# Altium project 2SlotElevator.PrjPcb
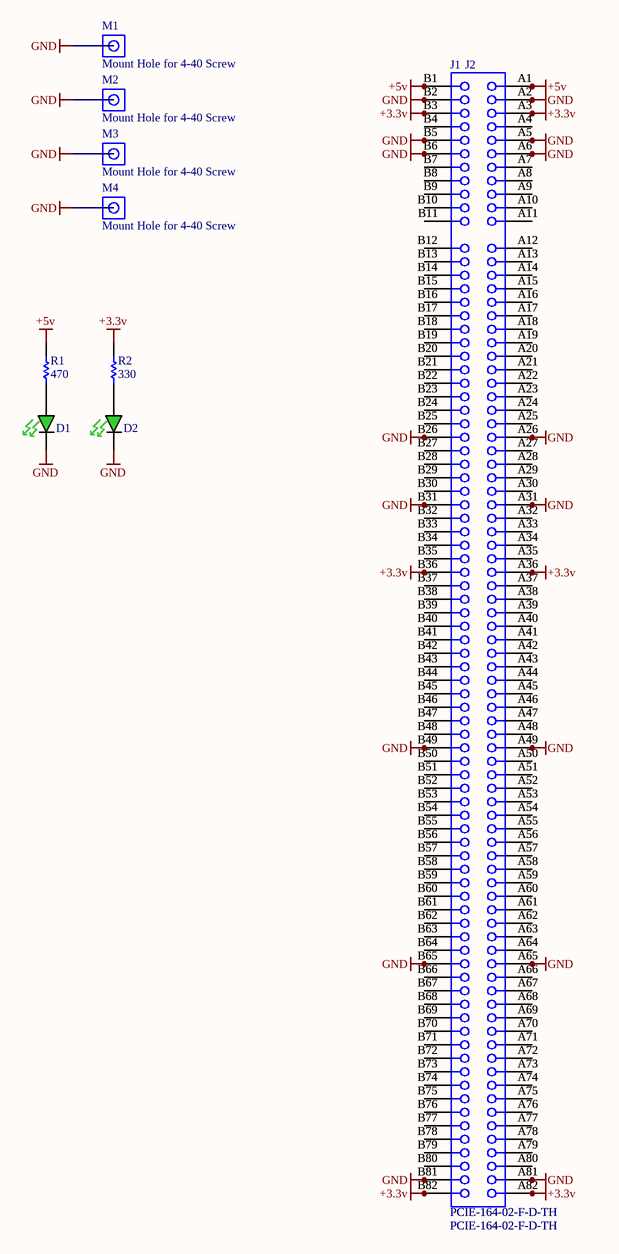
[diagram p0: 2SlotElevator.SchDoc]
DRCDate: 4/22/2012; Engineer: Eli Hughes; Rev: a; Title: 2 Slot Elevator
1 sheet, 10 parts. Net scope: global (net labels, ports and power ports of the same name join across sheets).
Board file: 2SlotElevator.PcbDoc

## Sheet 2SlotElevator.SchDoc: 2 Slot Elevator
size Tabloid

### Parts
D1  LED 3X1.5MM 568NM GN WTR CLR SMD  [LED_1206 - GREEN]  (value not drawn)
D2  LED 3X1.5MM 568NM GN WTR CLR SMD  [LED_1206 - GREEN]  (value not drawn)
J1  PCIE-164-02-F-D-TH  [PCIE-164-02-F-D-TH]
J2  PCIE-164-02-F-D-TH  [PCIE-164-02-F-D-TH]
M1  Mount Hole for 4-40 Screw  [4-40 Hole]  (no BOM)
M2  Mount Hole for 4-40 Screw  [4-40 Hole]  (no BOM)
M3  Mount Hole for 4-40 Screw  [4-40 Hole]  (no BOM)
M4  Mount Hole for 4-40 Screw  [4-40 Hole]  (no BOM)
R1  470  [R0603]
R2  330  [R0603]

### Nets
+3.3v: J1.A3 J1.A36 J1.A82 J1.B3 J1.B36 J1.B82 J2.A3 J2.A36 J2.A82 J2.B3 J2.B36 J2.B82 R2.2
+5v: J1.A1 J1.B1 J2.A1 J2.B1 R1.2
GND: D1.C D2.C J1.A2 J1.A5 J1.A6 J1.A26 J1.A31 J1.A49 J1.A65 J1.A81 J1.B2 J1.B5 J1.B6 J1.B26 J1.B31 J1.B49 J1.B65 J1.B81 J2.A2 J2.A5 J2.A6 J2.A26 J2.A31 J2.A49 J2.A65 J2.A81 J2.B2 J2.B5 J2.B6 J2.B26 J2.B31 J2.B49 J2.B65 J2.B81 M1.1 M2.1 M3.1 M4.1
NetD1_A: D1.A R1.1
NetD2_A: D2.A R2.1
NetJ1_A4: J1.A4 J2.A4
NetJ1_A7: J1.A7 J2.A7
NetJ1_A8: J1.A8 J2.A8
NetJ1_A9: J1.A9 J2.A9
NetJ1_A10: J1.A10 J2.A10
NetJ1_A11: J1.A11 J2.A11
NetJ1_A12: J1.A12 J2.A12
NetJ1_A13: J1.A13 J2.A13
NetJ1_A14: J1.A14 J2.A14
NetJ1_A15: J1.A15 J2.A15
NetJ1_A16: J1.A16 J2.A16
NetJ1_A17: J1.A17 J2.A17
NetJ1_A18: J1.A18 J2.A18
NetJ1_A19: J1.A19 J2.A19
NetJ1_A20: J1.A20 J2.A20
NetJ1_A21: J1.A21 J2.A21
NetJ1_A22: J1.A22 J2.A22
NetJ1_A23: J1.A23 J2.A23
NetJ1_A24: J1.A24 J2.A24
NetJ1_A25: J1.A25 J2.A25
NetJ1_A27: J1.A27 J2.A27
NetJ1_A28: J1.A28 J2.A28
NetJ1_A29: J1.A29 J2.A29
NetJ1_A30: J1.A30 J2.A30
NetJ1_A32: J1.A32 J2.A32
NetJ1_A33: J1.A33 J2.A33
NetJ1_A34: J1.A34 J2.A34
NetJ1_A35: J1.A35 J2.A35
NetJ1_A37: J1.A37 J2.A37
NetJ1_A38: J1.A38 J2.A38
NetJ1_A39: J1.A39 J2.A39
NetJ1_A40: J1.A40 J2.A40
NetJ1_A41: J1.A41 J2.A41
NetJ1_A42: J1.A42 J2.A42
NetJ1_A43: J1.A43 J2.A43
NetJ1_A44: J1.A44 J2.A44
NetJ1_A45: J1.A45 J2.A45
NetJ1_A46: J1.A46 J2.A46
NetJ1_A47: J1.A47 J2.A47
NetJ1_A48: J1.A48 J2.A48
NetJ1_A50: J1.A50 J2.A50
NetJ1_A51: J1.A51 J2.A51
NetJ1_A52: J1.A52 J2.A52
NetJ1_A53: J1.A53 J2.A53
NetJ1_A54: J1.A54 J2.A54
NetJ1_A55: J1.A55 J2.A55
NetJ1_A56: J1.A56 J2.A56
NetJ1_A57: J1.A57 J2.A57
NetJ1_A58: J1.A58 J2.A58
NetJ1_A59: J1.A59 J2.A59
NetJ1_A60: J1.A60 J2.A60
NetJ1_A61: J1.A61 J2.A61
NetJ1_A62: J1.A62 J2.A62
NetJ1_A63: J1.A63 J2.A63
NetJ1_A64: J1.A64 J2.A64
NetJ1_A66: J1.A66 J2.A66
NetJ1_A67: J1.A67 J2.A67
NetJ1_A68: J1.A68 J2.A68
NetJ1_A69: J1.A69 J2.A69
NetJ1_A70: J1.A70 J2.A70
NetJ1_A71: J1.A71 J2.A71
NetJ1_A72: J1.A72 J2.A72
NetJ1_A73: J1.A73 J2.A73
NetJ1_A74: J1.A74 J2.A74
NetJ1_A75: J1.A75 J2.A75
NetJ1_A76: J1.A76 J2.A76
NetJ1_A77: J1.A77 J2.A77
NetJ1_A78: J1.A78 J2.A78
NetJ1_A79: J1.A79 J2.A79
NetJ1_A80: J1.A80 J2.A80
NetJ1_B4: J1.B4 J2.B4
NetJ1_B7: J1.B7 J2.B7
NetJ1_B8: J1.B8 J2.B8
NetJ1_B9: J1.B9 J2.B9
NetJ1_B10: J1.B10 J2.B10
NetJ1_B11: J1.B11 J2.B11
NetJ1_B12: J1.B12 J2.B12
NetJ1_B13: J1.B13 J2.B13
NetJ1_B14: J1.B14 J2.B14
NetJ1_B15: J1.B15 J2.B15
NetJ1_B16: J1.B16 J2.B16
NetJ1_B17: J1.B17 J2.B17
NetJ1_B18: J1.B18 J2.B18
NetJ1_B19: J1.B19 J2.B19
NetJ1_B20: J1.B20 J2.B20
NetJ1_B21: J1.B21 J2.B21
NetJ1_B22: J1.B22 J2.B22
NetJ1_B23: J1.B23 J2.B23
NetJ1_B24: J1.B24 J2.B24
NetJ1_B25: J1.B25 J2.B25
NetJ1_B27: J1.B27 J2.B27
NetJ1_B28: J1.B28 J2.B28
NetJ1_B29: J1.B29 J2.B29
NetJ1_B30: J1.B30 J2.B30
NetJ1_B32: J1.B32 J2.B32
NetJ1_B33: J1.B33 J2.B33
NetJ1_B34: J1.B34 J2.B34
NetJ1_B35: J1.B35 J2.B35
NetJ1_B37: J1.B37 J2.B37
NetJ1_B38: J1.B38 J2.B38
NetJ1_B39: J1.B39 J2.B39
NetJ1_B40: J1.B40 J2.B40
NetJ1_B41: J1.B41 J2.B41
NetJ1_B42: J1.B42 J2.B42
NetJ1_B43: J1.B43 J2.B43
NetJ1_B44: J1.B44 J2.B44
NetJ1_B45: J1.B45 J2.B45
NetJ1_B46: J1.B46 J2.B46
NetJ1_B47: J1.B47 J2.B47
NetJ1_B48: J1.B48 J2.B48
NetJ1_B50: J1.B50 J2.B50
NetJ1_B51: J1.B51 J2.B51
NetJ1_B52: J1.B52 J2.B52
NetJ1_B53: J1.B53 J2.B53
NetJ1_B54: J1.B54 J2.B54
NetJ1_B55: J1.B55 J2.B55
NetJ1_B56: J1.B56 J2.B56
NetJ1_B57: J1.B57 J2.B57
NetJ1_B58: J1.B58 J2.B58
NetJ1_B59: J1.B59 J2.B59
NetJ1_B60: J1.B60 J2.B60
NetJ1_B61: J1.B61 J2.B61
NetJ1_B62: J1.B62 J2.B62
NetJ1_B63: J1.B63 J2.B63
NetJ1_B64: J1.B64 J2.B64
NetJ1_B66: J1.B66 J2.B66
NetJ1_B67: J1.B67 J2.B67
NetJ1_B68: J1.B68 J2.B68
NetJ1_B69: J1.B69 J2.B69
NetJ1_B70: J1.B70 J2.B70
NetJ1_B71: J1.B71 J2.B71
NetJ1_B72: J1.B72 J2.B72
NetJ1_B73: J1.B73 J2.B73
NetJ1_B74: J1.B74 J2.B74
NetJ1_B75: J1.B75 J2.B75
NetJ1_B76: J1.B76 J2.B76
NetJ1_B77: J1.B77 J2.B77
NetJ1_B78: J1.B78 J2.B78
NetJ1_B79: J1.B79 J2.B79
NetJ1_B80: J1.B80 J2.B80

### Notes on the sheet
- 2
- Wavenumber
- pl
- -1
- Rev:
- Technologies
- Sheet
- of

### Library data of the parts
D1 D2 = APL3015SGC-F01: Manufacturer: Kingbright Corp; Color: Green; Current - Test: 20mA; Wavelength - Peak: 565nm; Millicandela Rating: 20mcd; Voltage - Forward (Vf) Typ: 2.2V; Lens Type: Clear; Lens Style/Size: Rectangle, 2mm x 1.5mm; Viewing Angle: 70°; Value: LED 3X1.5MM 568NM GN WTR CLR SMD; Supplier 1: Digi-Key; Manufacturer Part Number: APL3015SGC-F01; RoHS: RoHS Compliant; Description: LED 3X1.5MM 568NM GN WTR CLR SMD; Category: Optoelectronics; Stock 1: 7999; Pricing 1: 1=0.15, 10=0.113, 25=0.09, 100=0.0825, 250=0.075, 500=0.0675, 1000=0.06 (USD); Luminous Flux @ Current - Test: -; Wavelength - Dominant: 568nm; Size / Dimension: 3.00mm L x 1.50mm W; Height: 1.40mm; Package / Case: 1206 (3216 Metric); Mounting Type: Surface Mount; Packaging: Cut Tape (CT); ComponentLink1URL: http://www.us.kingbright.com/images/catalog/SPEC/APL3015SGC-F01.pdf; ComponentLink1Description: http://www.us.kingbright.com/images/catalog/SPEC/APL3015SGC-F01.pdf; Supplier Part Number 1: 754-1111-1-ND
J1 J2 = PCIE-164-02-F-D-TH: SAMTEC - PCIE-164-02-F-D-TH - SOCKET, PCI-E, 2X82; Connector Type: Card Edge; Pitch Spacing: 1; No. of Contacts: 164; Gender: Receptacle; Contact Termination: Through Hole; No. of Rows: 2; SVHC: No SVHC; Supplier 1: Newark; Manufacturer: SAMTEC; Manufacturer Part Number: PCIE-164-02-F-D-TH; RoHS: YES; Category: Connectors; Stock 1: 599; Pricing 1: 1=3.51, 100=2.88, 250=2.65, 500=2.44, 1000=2.28 (USD); Contact Plating: Gold; Contact Material: Phosphor Bronze; ComponentLink1URL: http://www.farnell.com/cad/452718.pdf; ComponentLink1Description: http://www.farnell.com/cad/452718.pdf; ComponentLink2URL: http://www.farnell.com/datasheets/452706.pdf; ComponentLink2Description: http://www.farnell.com/datasheets/452706.pdf; Supplier Part Number 1: 33R0895; Value: PCIE-164-02-F-D-TH
M1-M4 = 4-40 Hole: Source: Digikey; Source Part Number: *; Manufacturer: *; Manufacturer Part Number: *; ROHS Certificate: *; Value: *
R1 = ERJ-3EKF4700V: RES 470 OHM 1/10W 1% 0603 SMD; Manufacturer: Panasonic - ECG; Power (Watts): 0.1W, 1/10W; Temperature Coefficient: ±100ppm/°C; Value: RES 470 OHM 1/10W 1% 0603 SMD; Supplier 1: Digi-Key; Manufacturer Part Number: ERJ-3EKF4700V; RoHS: RoHS Compliant; Category: Resistors; Stock 1: 296647; Pricing 1: 1=0.04, 50=0.015, 100=0.0114, 250=0.00844, 500=0.00624, 1000=0.00416 (USD); Resistance In Ohms: 470; Composition: Thick Film; Features: -; Tolerance: ±1%; Case: 0603 (1608 Metric); Size / Dimension: 0.063" L x 0.031" W (1.60mm x 0.80mm); Height: 0.018" (0.45mm); Lead Style: Surface Mount (SMD - SMT); Packaging: Cut Tape (CT); ComponentLink1URL: http://industrial.panasonic.com/www-cgi/jvcr13pz.cgi?E+PZ+3+AOA0002+ERJ3EKF4700V+7+WW; ComponentLink1Description: http://industrial.panasonic.com/www-cgi/jvcr13pz.cgi?E+PZ+3+AOA0002+ERJ3EKF4700V+7+WW; Supplier Part Number 1: P470HCT-ND
R2 = ERJ-3EKF3300V: RES 330 OHM 1/10W 1% 0603 SMD; Manufacturer: Panasonic - ECG; Manufacturer Part Number: ERJ-3EKF3300V; Supplier 1: Digikey; Supplier Part Number 1: P330HCT-ND; Value: RES 330 OHM 1/10W 1% 0603 SMD; ROHS Certificate: *